# EAGLE design Motor-Driver-30A-1 (EAGLE 9.5.2)
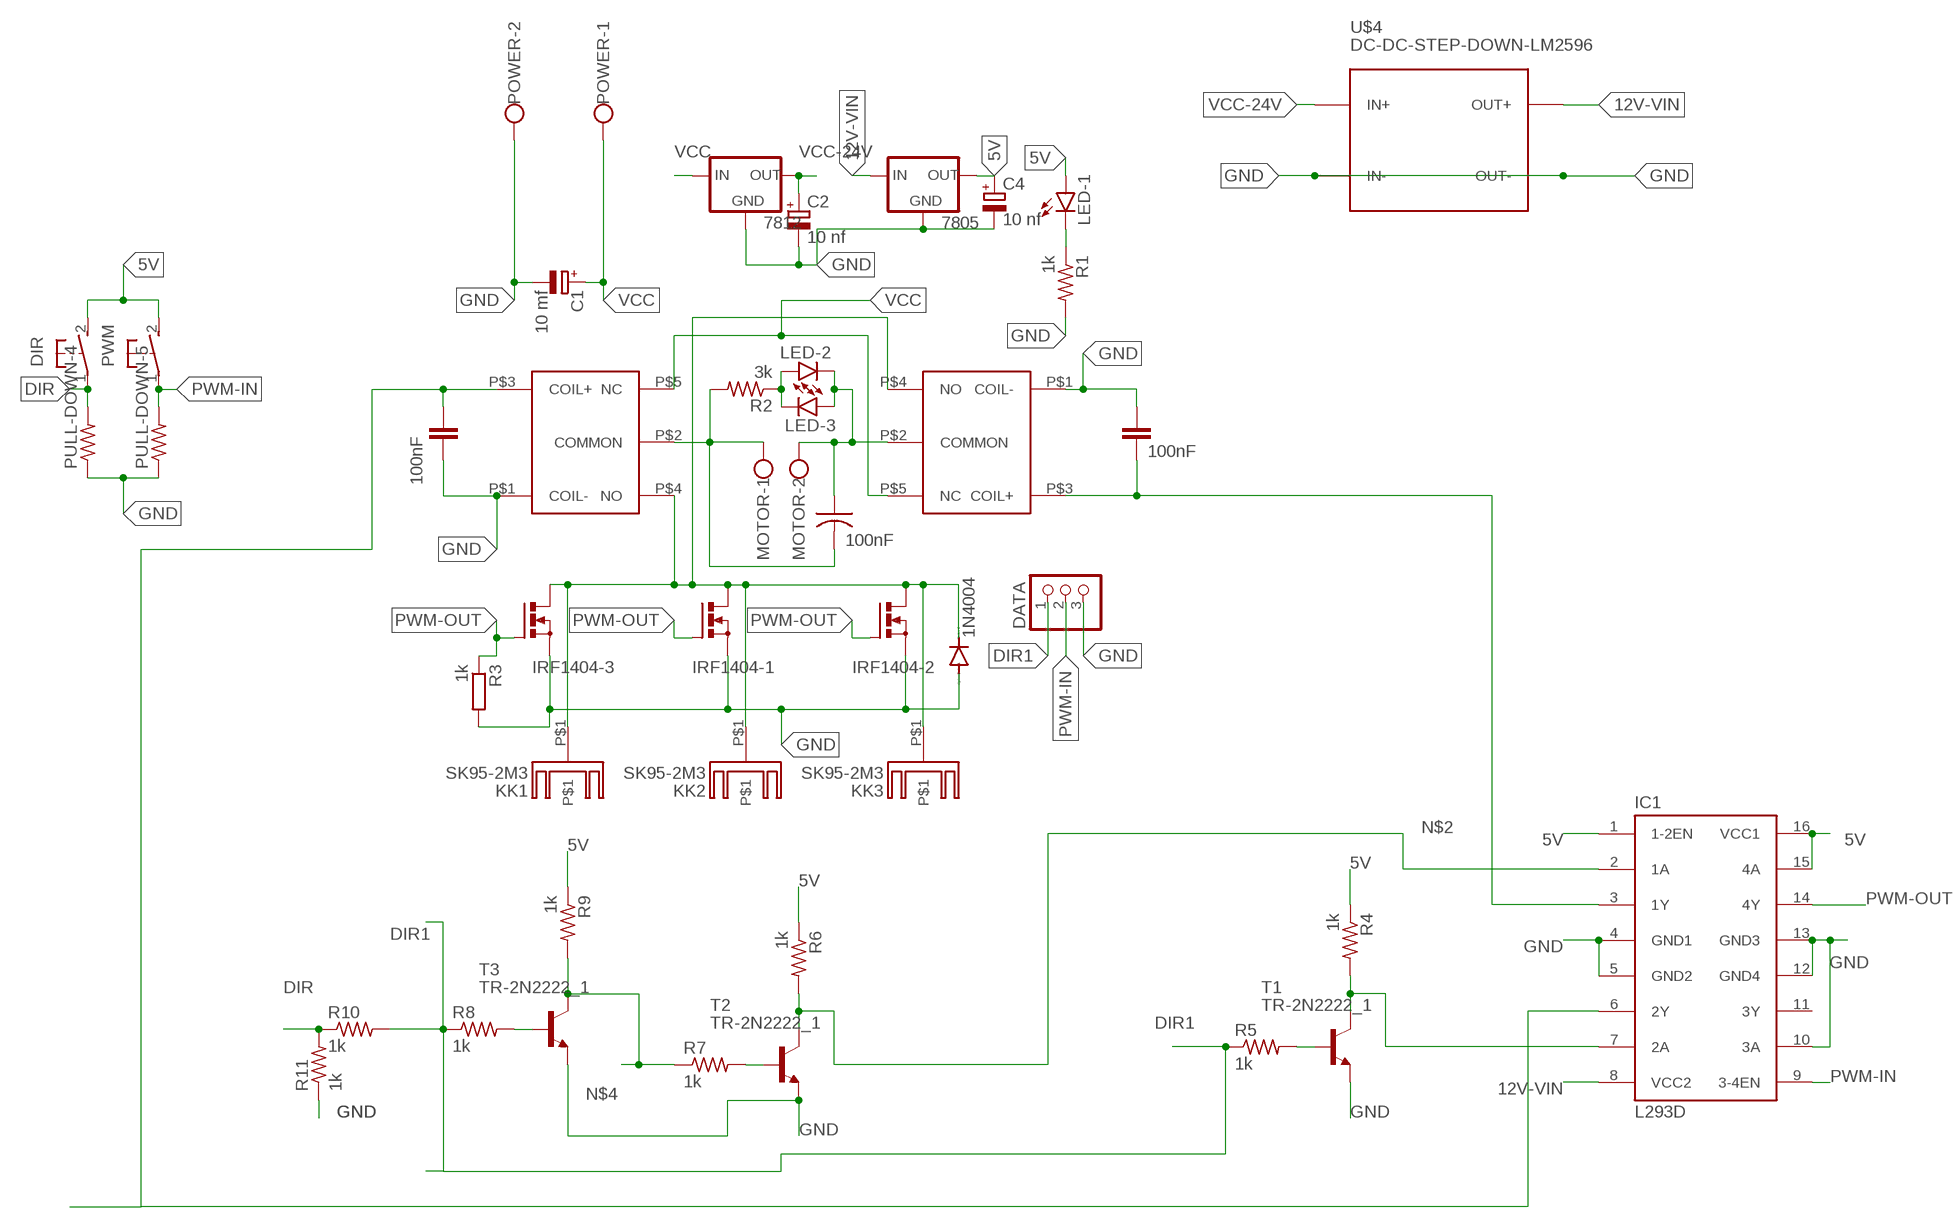
[diagram p0: schematic, sheet 1]

## Parts
7805  78XXL  [78XXL]
7812  78XXL  [78XXL]
C1  10 mf  CPOL-EUE2.5-7  [E2,5-7]
C2  10 nf  CPOL-EUE2.5-7  [E2,5-7]
C4  10 nf  CPOL-EUE2.5-7  [E2,5-7]
DATA  PINHD-3_DATA  [1X03_DATA]
DIR  PUSHBOTTON  [B3F-10XX]
IC1  L293D  [DIL16]
IRF1404-1  PMOSFET_NTO220BV  [TO220BV]
IRF1404-2  PMOSFET_NTO220BV  [TO220BV]
IRF1404-3  PMOSFET_NTO220BV  [TO220BV]
KK1  SK95-2M3  [SK95-2M3]
KK2  SK95-2M3  [SK95-2M3]
KK3  SK95-2M3  [SK95-2M3]
LED-1  LED3MM  [LED3MM]
LED-2  LED3MM  [LED3MM]
LED-3  LED3MM  [LED3MM]
MOTOR  W239-302  [W239-302]
POWER  W239-302  [W239-302]
PULL-DOWN-4  R-US_0204/7  [0204/7]
PULL-DOWN-5  R-US_0204/2V  [0204V]
PWM  PUSHBOTTON  [B3F-10XX]
R1  1k  R-US_0204/2V  [0204V]
R2  3k  R-US_0207/10  [0207/10]
R3  1k  R-EU_0204/7  [0204/7]
R4  1k  R-US_0204/7  [0204/7]
R5  1k  R-US_0204/5  [0204/5]
R6  1k  R-US_0204/7  [0204/7]
R7  1k  R-US_0204/2V  [0204V]
R8  1k  R-US_0204/5  [0204/5]
R9  1k  R-US_0204/7  [0204/7]
R10  1k  R-US_0204/2V  [0204V]
R11  1k  R-US_0204/2V  [0204V]
REVERSE-CURRENT  1N4004  [DO41-10]
T1  TR-2N2222_1  [TO92-EBC]
T2  TR-2N2222_1  [TO92-EBC]
T3  TR-2N2222_1  [TO92-EBC]
U$1  RELAY-30A  [RELAY-30A]
U$2  RELAY-30A  [RELAY-30A]
U$3  100nF  CAPACITOR  [C025-025X050]
U$4  DC-DC-STEP-DOWN-LM2596  [DC-DC-STEP-DOWN-LM2596]
U$5  100nF  CAPACITOR  [C025-025X050]
U$6  100nF  C-US075-032X103  [C075-032X103]

## Nets
003: IC1.3(1Y) U$2.P$3(COIL+) U$5.2
5V: 7805.OUT C4.+ DIR.2(S) IC1.1(1-2EN) IC1.15(4A) IC1.16(VCC1) LED-1.A PWM.2(S) R4.1 R6.1 R9.1
12V-VIN: 7805.IN IC1.8(VCC2) U$4.OUT+
45464: IC1.6(2Y) U$1.P$3(COIL+) U$3.1
DIR: DIR.1(P) PULL-DOWN-4.2 R10.1 R11.2
DIR1: DATA.1 R5.1 R8.1 R10.2
GND: 7805.GND 7812.GND C1.- C2.- C4.- DATA.3 IC1.4(GND1) IC1.5(GND2) IC1.10(3A) IC1.12(GND4) IC1.13(GND3) IRF1404-1.S IRF1404-2.S IRF1404-3.S POWER.2 PULL-DOWN-4.1 PULL-DOWN-5.1 R1.2 R3.2 R11.1 REVERSE-CURRENT.A T1.E T2.E T3.E U$1.P$1(COIL-) U$2.P$1(COIL-) U$3.2 U$4.IN- U$4.OUT- U$5.1
N$1: MOTOR.1 R2.2 U$1.P$2(COMMON) U$6.2
N$2: IC1.2(1A) R6.2 T2.C
N$3: LED-2.A LED-3.K(C) R2.1
N$4: R7.1 R9.2 T3.C
N$5: IRF1404-1.D IRF1404-2.D IRF1404-3.D KK1.P$1 KK2.P$1 KK3.P$1 REVERSE-CURRENT.C U$1.P$4(NO) U$2.P$4(NO)
N$6: IC1.7(2A) R4.2 T1.C
N$7: R5.2 T1.B
N$8: R7.2 T2.B
N$9: LED-1.K(C) R1.1
N$10: R8.2 T3.B
N$20: LED-2.K(C) LED-3.A MOTOR.2 U$2.P$2(COMMON) U$6.1
PWM-IN: DATA.2 IC1.9(3-4EN) PULL-DOWN-5.2 PWM.1(P)
PWM-OUT: IC1.14(4Y) IRF1404-1.G IRF1404-2.G IRF1404-3.G R3.1
VCC: 7812.IN C1.+ POWER.1 U$1.P$5(NC) U$2.P$5(NC)
VCC-24V: 7812.OUT C2.+ U$4.IN+
Unconnected: IC1.11(3Y)

## Library data of the parts
7805 = v-reg:78XXL: VOLTAGE REGULATOR
7812 = MIA_LIBRARY-2-2-2:78XXL: VOLTAGE REGULATOR
C1 C2 C4 = rcl:CPOL-EU: POLARIZED CAPACITOR, European symbol; SPICEPREFIX: C
DATA = MIA_LIBRARY-2-2-2:PINHD-3_DATA: PIN HEADER
DIR PWM = CUSTOM:PUSHBOTTON
IC1 = MIA_LIBRARY-2-2-2:L293D: PUSH-PULL 4 CHANNEL DRIVER; MPN: L293D; OC_FARNELL: 9589619; OC_NEWARK: 56P8249
IRF1404-1-IRF1404-3 = transistor-power:PMOSFET_N: Power MOSFET N-Channel
KK1-KK3 = heatsink:SK95-2M3: HEATSINK manufacturer Fischer/distributor Buerklin
LED-1-LED-3 = led:LED: LED OSRAM: - CHIPLED LG R971, LG N971, LY N971, LG Q971, LY Q971, LO R971, LY R971 LH N974, LH R974 LS Q976, LO Q976, LY Q976 LO Q996 - Hyper CHIPLED LW Q18S LB Q993, LB Q99A, LB R99A - SideLED LS A670, LO A670, LY A670, LG A670, LP A670 LB A673, LV A673, LT A673, LW A673 LH A674 LY A675 LS A676, LA A676, LO A676, LY A676, LW A676 LS A679, LY A679, LG A679 - Hyper Micro SIDELED® LS Y876, LA Y876, LO Y876, LY Y876 LT Y87S - SmartLED LW L88C, LW L88S LB L89C, LB L89S, LG L890 LS L89K, LO L89K, LY L89K LS L896, LA L896, LO L896, LY L896 - TOPLED LS T670, LO T670, LY T670, LG T670, LP T670 LSG T670, LSP T670, LSY T670, LOP T670, LYG T670 LG T671, LOG T671, LSG T671 LB T673, LV T673, LT T673, LW T673 LH T674 LS T676, LA T676, LO T676, LY T676, LB T676, LH T676, LSB T676, LW T676 LB T67C, LV T67C, LT T67C, LS T67K, LO T67K, LY T67K, LW E67C LS E67B, LA E67B, LO E67B, LY E67B, LB E67C, LV E67C, LT E67C LW T67C LS T679, LY T679, LG T679 LS T770, LO T770, LY T770, LG T770, LP T770 LB T773, LV T773, LT T773, LW T773 LH T774 LS E675, LA E675, LY E675, LS T675 LS T776, LA T776, LO T776, LY T776, LB T776 LHGB T686 LT T68C, LB T68C - Hyper Mini TOPLED® LB M676 - Mini TOPLED Santana® LG M470 LS M47K, LO M47K, LY M47K Source: http://www.osram.convergy.de LUXEON: - LUMILED® LXK2-PW12-R00, LXK2-PW12-S00, LXK2-PW14-U00, LXK2-PW14-V00 LXK2-PM12-R00, LXK2-PM12-S00, LXK2-PM14-U00 LXK2-PE12-Q00, LXK2-PE12-R00, LXK2-PE12-S00, LXK2-PE14-T00, LXK2-PE14-U00 LXK2-PB12-K00, LXK2-PB12-L00, LXK2-PB12-M00, LXK2-PB14-N00, LXK2-PB14-P00, LXK2-PB14-Q00 LXK2-PR12-L00, LXK2-PR12-M00, LXK2-PR14-Q00, LXK2-PR14-R00 LXK2-PD12-Q00, LXK2-PD12-R00, LXK2-PD12-S00 LXK2-PH12-R00, LXK2-PH12-S00 LXK2-PL12-P00, LXK2-PL12-Q00, LXK2-PL12-R00 Source: www.luxeon.com KINGBRIGHT: KA-3528ASYC Source: www.kingbright.com
MOTOR POWER = con-wago-500:W239-302: WAGO SCREW CLAMP; OC_FARNELL: unknown; OC_NEWARK: unknown
PULL-DOWN-4 PULL-DOWN-5 R1 R2 R4-R11 = rcl:R-US_: RESISTOR, American symbol; SPICEPREFIX: R
R3 = rcl:R-EU_: RESISTOR, European symbol; SPICEPREFIX: R
REVERSE-CURRENT = diode:1N4004: DIODE general purpose rectifier, 1 A
T1-T3 = MIA_LIBRARY-2-2-2:TR-2N2222_1: NPN TRANSISTOR
U$1 U$2 = Relay 30A:RELAY-30A
U$3 U$5 = MIA_LIBRARY-2-2:CAPACITOR
U$4 = MIA_LIBRARY-2-2-2:DC-DC-STEP-DOWN-LM2596: DC/DC Step-Down Regulator based on LM2596-ADJ chip LM2596 datasheet available here: http://www.ti.com/lit/ds/symlink/lm2596.pdf Click here to find device on ebay.com <http://www.ebay.com/sch/lm2596+power+regulator>
U$6 = rcl:C-US: CAPACITOR, American symbol; SPICEPREFIX: C

## Board
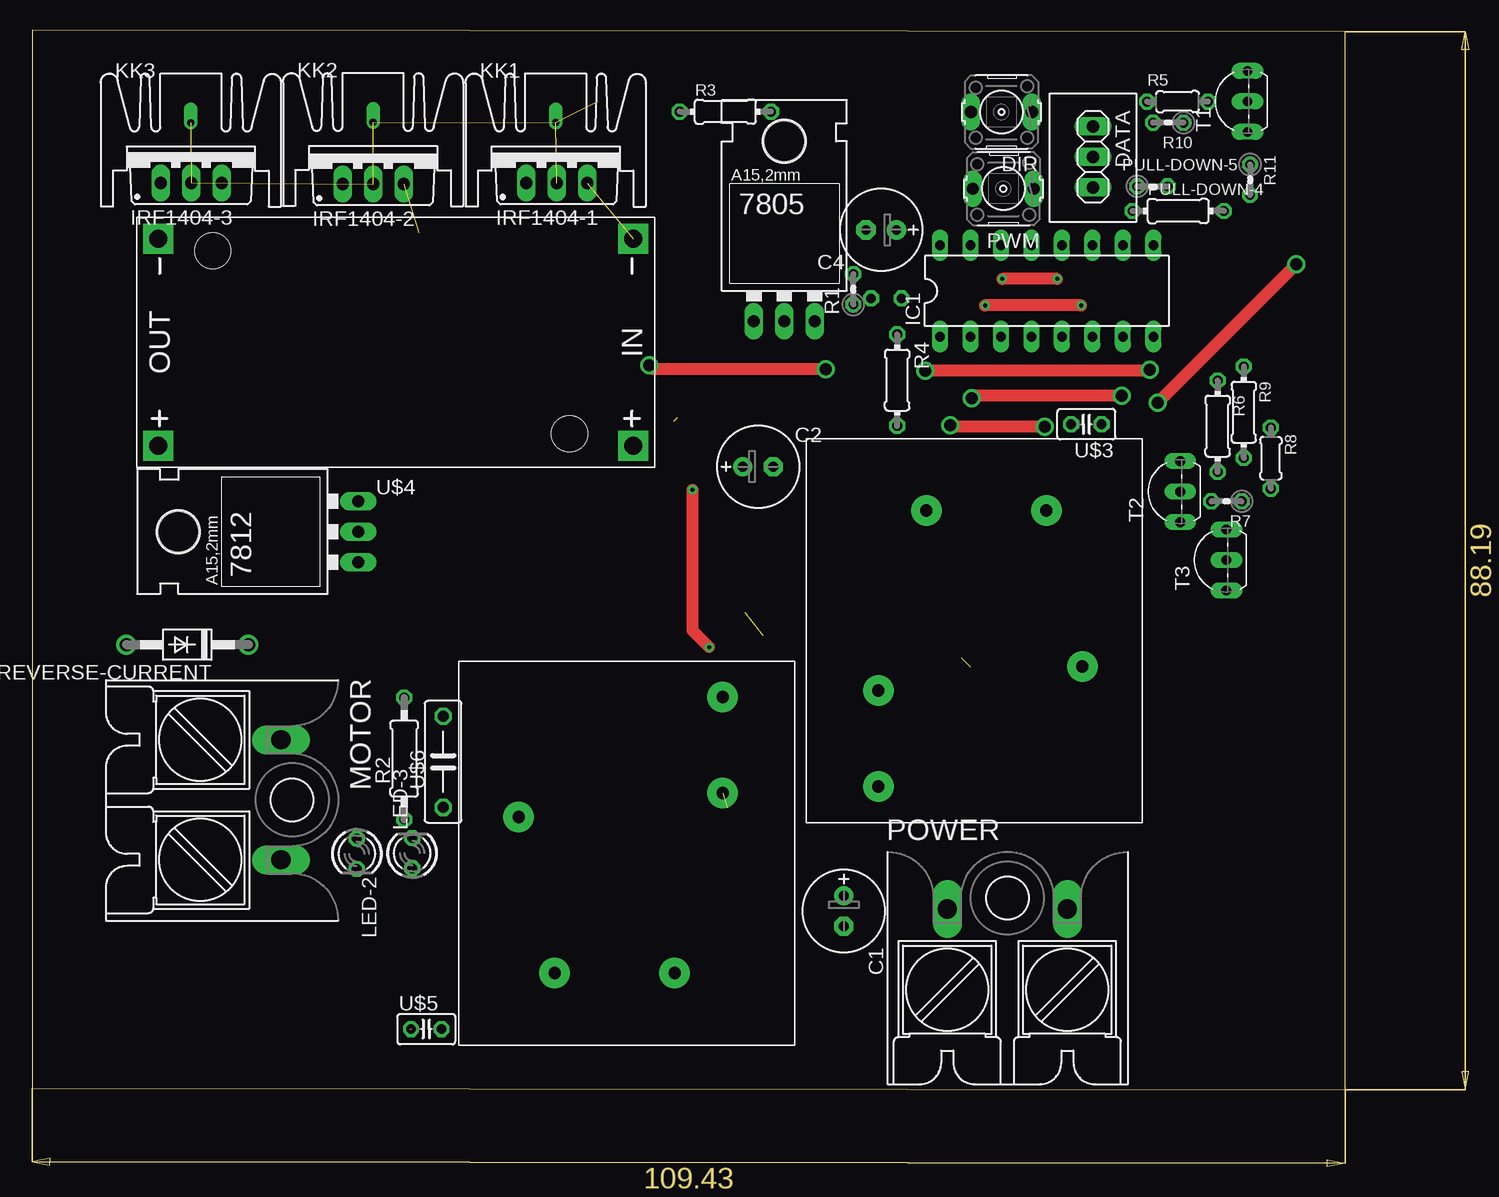
[diagram p1: board, top side]
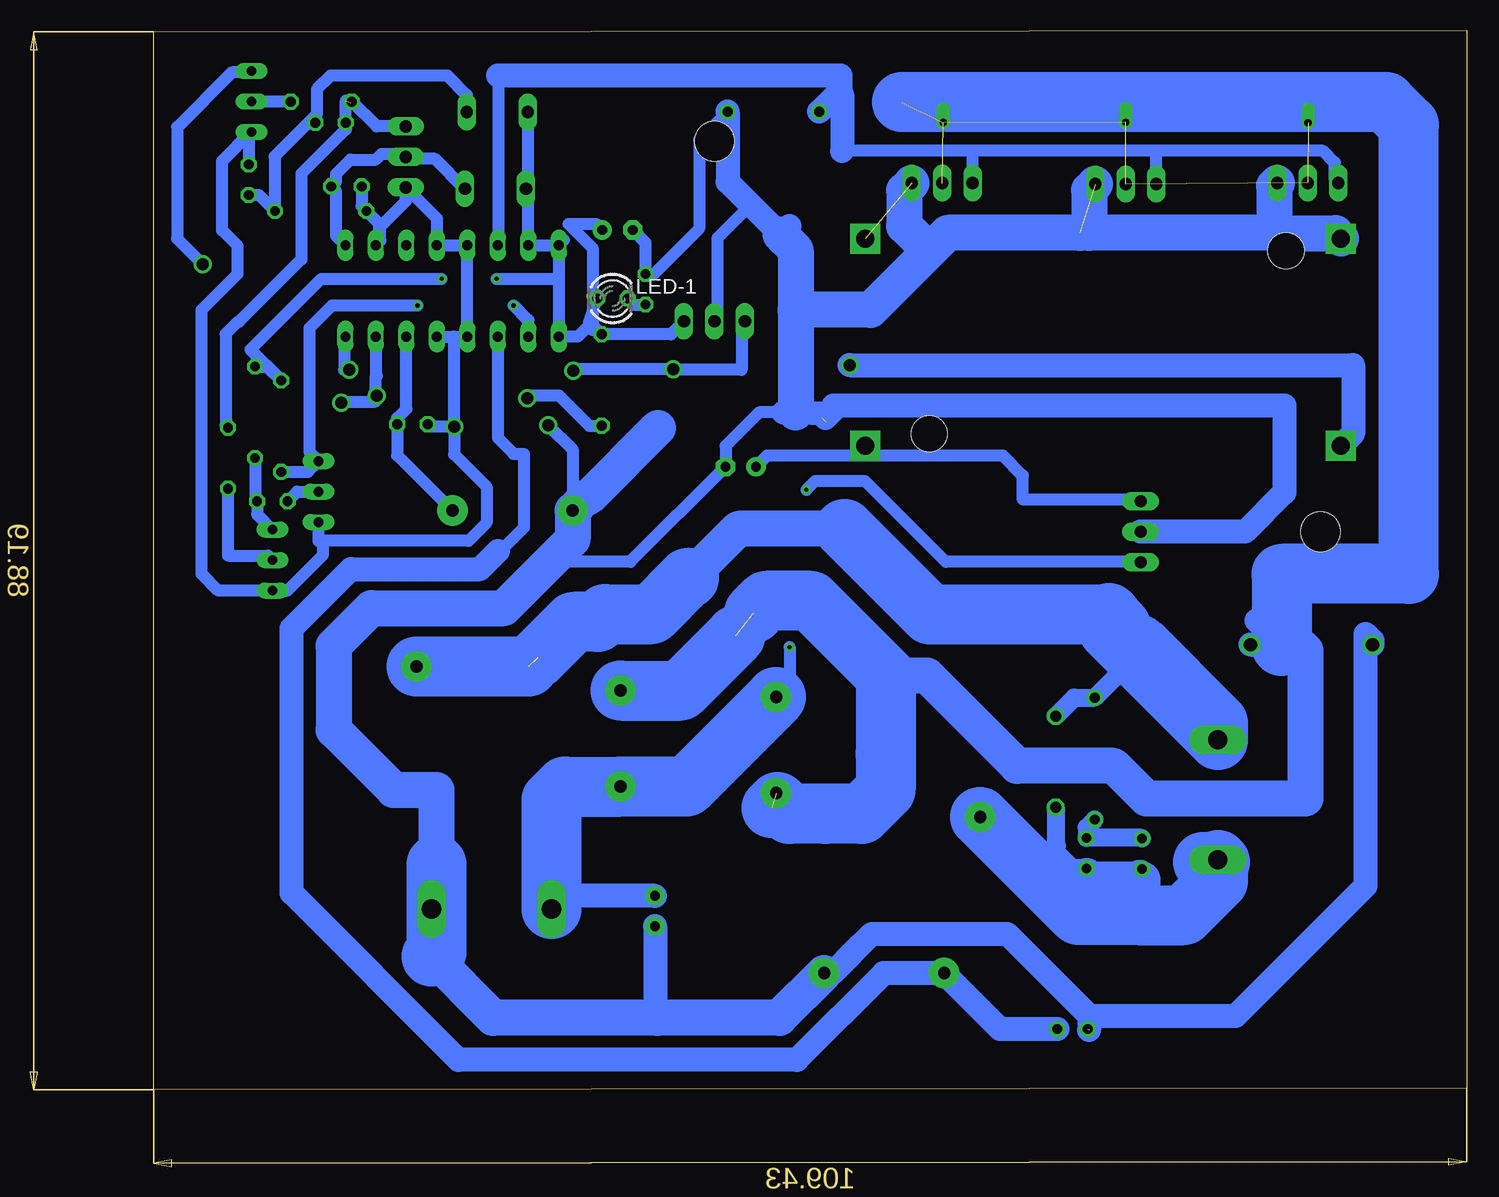
[diagram p2: board, bottom side, seen from below]

Size 109.43 x 88.32 mm. Coordinates in mm from the lower left corner, seen from the top.
Outline: 0,0.13 109.43,0 109.43,88.19 0,88.32 0,0.13
Copper layers (1*16): Top 0.035mm / dielectric 1.5mm / Bottom 0.035mm
Design rules "default *": minimum track width 6mil, minimum drill 0.35mm, track to track 1mm, track to pad 1mm, pad to pad 1mm, via to via 1mm, smd to smd 6mil, copper to edge 40mil, drill to drill 6mil, minimum pad ring 10mil, minimum via ring 8mil, stop-mask expansion 4mil, vias tented up to drill 0mil, thermal gap 10mil

### Footprints (pad centres in the part's own frame; a part is rotated, then mirrored left to right if it is on the bottom)
78XXL = drill 1.016 long: GND 0,-3.81; IN -2.54,-3.81; OUT 2.54,-3.81 | hole 3.302: 0,11.176
E2,5-7 = drill 0.813 pad 1.6: + -1.27,0 | drill 0.813 pad 1.6 octagon: - 1.27,0
1X03_DATA = drill 1.016 long: 1 -2.54,0; 2 0,0; 3 2.54,0
B3F-10XX = drill 1.016 long: 1 -2.54,0; 2 2.54,0
DIL16 = drill 0.813 long: 1 -8.89,-3.81; 2 -6.35,-3.81; 3 -3.81,-3.81; 4 -1.27,-3.81; 5 1.27,-3.81; 6 3.81,-3.81; 7 6.35,-3.81; 8 8.89,-3.81; 9 8.89,3.81; 10 6.35,3.81; 11 3.81,3.81; 12 1.27,3.81; 13 -1.27,3.81; 14 -3.81,3.81; 15 -6.35,3.81; 16 -8.89,3.81
TO220BV = drill 1.016 long: D 0,-2.54; G -2.54,-2.54; S 2.54,-2.54
SK95-2M3 = drill 0.6 offset: P$1 0,2
LED3MM = drill 0.813 octagon: A -1.27,0; K 1.27,0
W239-302 = drill 1.6 long: 1 -5,5; 2 5,5
0204/7 = drill 0.813 octagon: 1 -3.81,0; 2 3.81,0
0204V = drill 0.813 octagon: 1 -1.27,0; 2 1.27,0
0207/10 = drill 0.813 octagon: 1 -5.08,0; 2 5.08,0
0204/5 = drill 0.813 octagon: 1 -2.54,0; 2 2.54,0
DO41-10 = drill 1.118: A 5.08,0; C -5.08,0
TO92-EBC = drill 0.813 long: B 0,-1.27; C 2.54,-1.27; E -2.54,-1.27
RELAY-30A = drill 1.016 pad 2.54: P$1 10,26; P$2 23,13; P$3 20,26; P$4 6,11; P$5 6,3
C025-025X050 = drill 0.813 octagon: 1 -1.27,0; 2 1.27,0
DC-DC-STEP-DOWN-LM2596 = drill 1.5 pad 2.5 square: IN+ -19.812,8.636; IN- -19.812,-8.636; OUT+ 19.812,8.636; OUT- 19.812,-8.636 | hole 3: -14.478,7.62; 15.24,-7.62
C075-032X103 = drill 0.914 octagon: 1 -3.81,0; 2 3.81,0

### Placement (x,y rotation side)
7805  62.69,67.86 0 top
7812  23.37,46.51 90 top
C1  67.64,14.9 270 top
C2  60.5,51.93 0 top
C4  70.76,71.66 180 top
DATA  88.41,77.74 270 top
DIR  80.78,81.48 180 top
IC1  84.56,66.57 0 top
IRF1404-1  43.72,78.1 0 top
IRF1404-2  28.42,78.02 0 top
IRF1404-3  13.26,78.11 0 top
KK1  43.63,78.6 0 top
KK2  28.41,78.64 0 top
KK3  13.23,78.6 0 top
LED-1  71.19,65.95 0 bottom
LED-2  27.05,19.67 270 top
LED-3  31.68,19.72 90 top
MOTOR  15.75,24.17 270 top
POWER  81.27,10.07 0 top
PULL-DOWN-4  95.5,73.24 0 top
PULL-DOWN-5  93.36,75.28 0 top
PWM  80.94,75.09 180 top
R1  68.44,66.71 90 top
R2  31.01,27.6 90 top
R3  57.77,81.51 0 top
R4  72.09,59.15 270 top
R5  95.46,82.35 0 top
R6  98.8,55.3 270 top
R7  99.53,49.04 180 top
R8  103.23,52.63 270 top
R9  100.97,56.46 270 top
R10  94.68,80.59 180 top
R11  101.5,75.84 270 top
REVERSE-CURRENT  12.94,37.09 180 top
T1  100.01,82.36 90 top
T2  94.41,49.84 90 top
T3  98.25,44.14 90 top
U$1  64.52,22.27 0 top
U$2  63.55,35.73 180 top
U$3  87.86,55.46 180 top
U$4  30.3,62.29 180 top
U$5  32.85,5.06 0 top
U$6  34.25,27.34 90 top

### Tracks (layer width: path | path; a pad name or v marks a point on that pad's centre or on a via)
003
  Bottom 1: IC1.3 80.75,54.32 79.43,53 78.57,53 78.57,46.86 80.55,44.88 80.75,44.88
  Bottom 2: 80.75,44.88 82.23,43.39 92.98,43.39 97.93,38.45 97.93,16.41 84.02,2.5 55.83,2.5 48.6,9.73 U$2.P$3 38.88,5.06 U$5.2
5V  (via drill 0.35)
  Top 1: v85.42,67.58 v80.85,67.58
  Bottom 1: IC1.16 IC1.15 78.21,81.45 DIR.2 78.24,75.25 PWM.2 | IC1.16 75.67,67.58 | 75.67,67.58 IC1.1 74.09,62.76 72.85,64 | 75.23,70.82 IC1.16 | 72.85,64 72.85,70.15 74.87,72.17 72.54,72.17 C4.+ | 72.85,64 72.85,63.32 R4.1 | R4.1 73.13,64 LED-1.A | R9.1 99.95,60.27 R6.1 101.36,61.67 95.46,67.58 v85.42,67.58 | v80.85,67.58 75.67,67.58 | 7805.OUT 66.33,62.96 R4.1
12V-VIN  (via drill 1)
  Top 1: v93.13,60 93.05,59.92 v74.45,59.92 | v51.43,60.38 51.75,60.06 v66.14,60.06
  Bottom 1: v93.13,60 93.56,60 93.56,62.65 IC1.8 | 74.45,60.03 v74.45,59.92 74.3,60.06 v66.14,60.06 66.08,60 60.43,60 60.43,63.77 7805.IN
  Bottom 2: U$4.OUT+ 9.48,54.67 9.48,60.38 v51.43,60.38
45464
  Bottom 1: U$1.P$3 89.12,52.88 U$3.1 89.12,55.97 88.37,56.73 IC1.6
DIR
  Bottom 1: 96.47,80.66 95.82,81.31 95.82,83.37 94.68,84.51 84.94,84.51 83.32,82.89 DIR.1 | 96.47,80.66 99.35,77.78 99.35,73.27 PULL-DOWN-4.2 | 95.79,80.75 R10.1 96.02,80.66 96.47,80.66 | 96.47,80.48 96.47,80.66 | 99.97,73.89 PULL-DOWN-4.2 | R11.2 100.65,74.57 PULL-DOWN-4.2
DIR1  (1 unrouted)
  Bottom 1: DATA.1 90.85,80.28 R5.1 93,82.27 | 93.41,82.43 R10.2 93.41,80.04 97.11,76.34 97.11,69.21 102.32,64 102.43,64 103.43,63 103.43,55.37 R8.1
GND  (via drill 1)  (4 unrouted)
  Top 1: v76.53,55.39 76.65,55.27 v84.39,55.27
  Bottom 1: U$2.P$1 50.78,12.5 | IC1.5 84.43,62.76 | 84.43,62.76 IC1.4 IC1.13 IC1.12 85.83,72.61 DATA.3 88.41,74.05 90.53,71.94 90.53,70.76 IC1.10 90.68,70.61 90.68,72.22 PULL-DOWN-4.1 92.09,73.63 PULL-DOWN-5.1 | 84.43,55.31 v84.39,55.27 84.39,52.96 81.67,50.24 81.67,47.25 83.17,45.75 95.3,45.75 | v76.53,55.39 74.52,53.37 U$1.P$1 | 84.43,62.76 84.43,55.31 | U$5.1 31.43,5.21 | C4.- 68.44,70.61 R1.2 67.75,67.98 63.96,71.77 63.96,79.13 R3.2 | U$3.2 86.43,55.31 84.43,55.31 | 53.43,55.69 53.43,56 53.43,56.35 | 53.75,56 56.43,56 | 95.3,45.75 95.3,44.59 98.29,41.6 T3.E 104.03,41.6 105.43,43 105.43,65 102.43,68 102.43,70.33 103.72,71.62 103.72,77.39 T1.E 101.5,79.6 R11.1 | T2.E 95.68,45.75 95.3,45.75 | 74.52,45.86 74.43,45.77 74.43,45 75.43,45 75.43,44 69.7,44 C2.- 61.77,53.66 58.98,56.45 56.92,56.45 | 7805.GND 62.43,64.31 62.43,71 60.18,73.25 59.18,73.25
  Bottom 2: C1.- 67.64,6.21 67.43,6 | U$2.P$1 52.84,9.73 49.57,13 38.3,13 31.46,6.16 | 31.46,6.16 31.46,5 | 31.46,6.16 19.27,6.16 8.43,17 8.43,38 7.86,37.43 REVERSE-CURRENT.A | 56.43,72 56.92,71.51 56.92,71 59.18,73.25 61.59,75.66 R3.2 | 53.43,56.35 55.92,56.42 56.92,56.45 | 53.43,56 52.78,56.65 52.78,57.04 15.19,57.04 15.19,49.79 18.48,46.51 7812.GND
  Bottom 3: 85.87,18.77 85.87,25 89.43,25 94.43,30 94.43,37 91.28,40.15 80.23,40.15 74.52,45.86 U$1.P$1 73.44,49.35 73.22,49.35 67.41,55.16 | U$2.P$1 57.28,6 67.43,6 81.16,6 86.27,11.11 POWER.2 | 57.18,71.25 56.92,71 55.92,70 55.92,65 | 55.92,65 55.92,56.42 | IRF1404-3.S 16.05,75.32 16.05,71.41 | 16.05,71.41 31.47,71.41 31.47,74.97 IRF1404-2.S | 32.23,71.41 43.27,71.41 44.79,69.89 | 44.79,69.89 49.68,65 55.92,65 | IRF1404-1.S 46.9,74.93 46.9,71.99 44.79,69.89 | 16.05,71.41 16.02,71.38 10.95,71.38 U$4.OUT-
  Bottom 5: 85.87,18.77 85.87,11.5 86.27,11.11
N$1  (1 unrouted)
  Bottom 1: 29.81,39.75 29.81,39.62 | 28.81,38.62 28.81,37.23 | 29.81,38.23 27.5,35.92 MOTOR.1 27.31,35.73 27.31,37.12 28.45,35.98
  Bottom 1.5: U$6.2 32.72,32.68 R2.2 28.69,35 28.43,35 27.5,35.92
  Bottom 3: 51.86,46.75 60.7,46.75 64.79,42.65
  Bottom 5: 78.19,35.27 U$1.P$2 | 29.6,39.54 29.81,39.75 | 29.81,38.23 28.81,37.23 MOTOR.1 20.75,30.56 27.31,37.12 | 28.81,38.62 29.79,39.6 44.72,39.6 51.86,46.75 | 64.79,42.65 64.92,42.65 67.94,39.63 71.79,39.63 72.43,39 74.43,39 77.43,36
N$2  (via drill 0.35)
  Top 1: v87.43,65.36 v79.43,65.36
  Bottom 1: IC1.2 78.21,64.14 v79.43,65.36 | v87.43,65.36 94.56,65.36 96.45,63.48 96.45,53.14 T2.C 96.57,51.49 R6.2
N$3
  Bottom 1: LED-3.K 31.63,20.94 LED-2.A
  Bottom 1.5: LED-2.A 27.11,20.99 LED-3.K 31.68,21.84 R2.1
N$4
  Bottom 1: T3.C 100.8,47.96 R7.1 100.97,49.21 R9.2
N$5  (8 unrouted)
  Bottom 1: U$2.P$4 54.16,24.73 53.43,24 | 53.43,23 51.43,25 48.43,25 47.43,25 47.43,27 48.43,28
  Bottom 2: 13.43,36.59 15.02,36.59 15.43,37 15.93,37.5 | 15.93,37.5 17.52,39.09 | REVERSE-CURRENT.C 16.34,37.09 15.93,37.5
  Bottom 3: 48.43,34.52 44.98,34.52 37.46,27 29.43,27 26.68,24.25 13.43,24.25 13.43,36.59 13.68,36.84
  Bottom 5: U$1.P$4 65.51,33.27 60.92,37.86 | 57.93,23.5 57.43,24 56.43,23 53.43,23 50.43,23 48.43,25 48.43,28 48.43,34.52 54.66,40.75 58.41,40.75 59.41,39.75 | 15.43,37 15.43,43 4.83,43 4.83,80.4 6.74,82.31 47.07,82.31
N$6  (via drill 1)
  Top 1: v78.29,57.62 78.53,57.85 v90.81,57.85 | v105.33,68.8 105.08,68.54 105.1,68.54 v93.79,57.24
  Bottom 1: IC1.7 90.91,59.59 90.8,59.48 90.94,59.34 90.94,57.98 | 90.94,57.98 90.94,57.35 93.69,57.35 v93.79,57.24 | 90.94,57.98 v90.81,57.85 | v78.29,57.62 78.03,57.87 75.66,57.87 73.12,55.34 R4.2 72.03,55.34 | T1.C 101.4,84.78 102.92,84.78 107.48,80.22 107.48,70.94 v105.33,68.8
N$7
  Bottom 1: T1.B 98.02,82.36 R5.2
N$8
  Bottom 1: R7.2 97.47,49.84 T2.B
N$9
  Bottom 1: LED-1.K 69.41,65.44 R1.1 68.51,65.44
N$10
  Bottom 1: T3.B 99.91,44.52 103.23,44.52 R8.2
N$20
  Bottom 1: 34.13,20.3 34.43,20 33.93,19.5 | LED-3.A 31.63,18.4 27.43,18.4
  Bottom 1.5: U$6.1 34.25,20.43 34.13,20.3 | LED-3.A 32.88,18.45 33.93,19.5 | LED-2.K 27.43,18.4 27,17.97 27,17.54
  Bottom 3: 27.43,14.55 27,14.98 27,17.54 31.7,17.54 | 32.37,14.55 32.37,16.87 31.7,17.54 | 31.7,17.8 31.7,17.54
  Bottom 5: U$2.P$2 32.37,14.55 27.43,14.55 23.58,14.55 20.75,17.39 MOTOR.2 20.58,19 21.98,19
PWM-IN
  Bottom 1: PWM.1 85.97,77.57 88.25,77.57 DATA.2 88.68,78 90.43,78 90.92,77.51 93.04,77.51 94.25,76.3 94.25,75.67 PULL-DOWN-5.2 | 94.63,75.52 PULL-DOWN-5.2 | PULL-DOWN-5.2 94.25,74.9 94.25,71.19 IC1.9
PWM-OUT
  Bottom 1: 80.72,84.54 80.72,70.4 IC1.14 | IRF1404-3.G 10.99,75.85 10.99,77.27 11.97,78.25 25.73,78.25 | 25.73,78.25 41.1,78.25 | 41.1,78.25 52.05,78.25 | IRF1404-2.G 25.88,78.1 25.73,78.25 | IRF1404-1.G 41.18,78.17 41.1,78.25
  Bottom 2: 80.72,84.54 52.2,84.54 52.2,83.27 R3.1 | 52.05,82.95 52.05,78.25
VCC  (via drill 0.35)
  Top 1: v55.03,50 55.03,38.29 v56.43,36.89
  Bottom 1: v55.03,50 54.29,50.75 50.18,50.75 43.41,43.98 27.51,43.98 27.33,43.81 7812.IN | v56.43,36.89 56.43,33 57.43,33 57.55,32.88 U$2.P$5
  Bottom 2: C1.+ 75.17,16.17 POWER.1
  Bottom 5: U$2.P$5 65.01,25.27 U$1.P$5 75.16,25.27 76.27,24.16 POWER.1
VCC-24V
  Bottom 1: 7812.OUT 27.32,49.19 36.98,49.19 36.98,51.19 38.64,52.85 50.92,52.85 | U$4.IN+ 50.92,52.85 | C2.+ 58.31,52.85 50.92,52.85